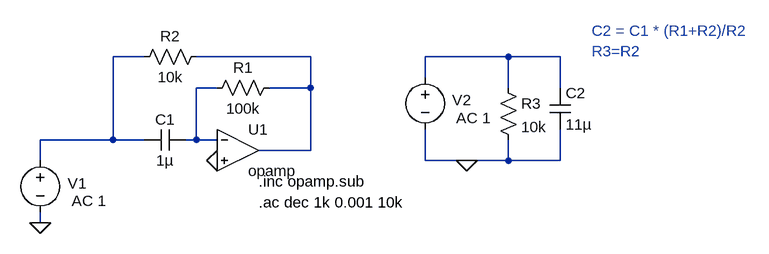
[diagram p0: schematic EJE3_A.asc]
EJE3_A.asc, the LTspice schematic file:
Version 4
SHEET 1 928 680
WIRE -32 -48 -80 -48
WIRE 224 -48 48 -48
WIRE 528 -48 400 -48
WIRE 608 -48 528 -48
WIRE 400 -16 400 -48
WIRE 80 0 48 0
WIRE 224 0 224 -48
WIRE 224 0 160 0
WIRE 528 0 528 -48
WIRE 608 0 608 -48
WIRE -80 80 -80 -48
WIRE -80 80 -192 80
WIRE -32 80 -80 80
WIRE 48 80 48 0
WIRE 48 80 32 80
WIRE 80 80 48 80
WIRE 224 96 224 0
WIRE 224 96 144 96
WIRE -192 112 -192 80
WIRE 400 112 400 64
WIRE 464 112 400 112
WIRE 528 112 528 80
WIRE 528 112 464 112
WIRE 608 112 608 64
WIRE 608 112 528 112
WIRE -192 208 -192 192
FLAG 80 112 0
FLAG -192 208 0
FLAG 464 112 0
SYMBOL OpAmps\\opamp 112 32 R0
SYMATTR InstName U1
SYMATTR SpiceLine2 GBW=100Meg
SYMBOL voltage -192 96 R0
WINDOW 0 42 51 Left 2
WINDOW 123 48 78 Left 2
WINDOW 39 0 0 Left 0
SYMATTR InstName V1
SYMATTR Value ""
SYMATTR Value2 AC 1
SYMBOL cap 32 64 R90
WINDOW 0 0 32 VBottom 2
WINDOW 3 32 32 VTop 2
SYMATTR InstName C1
SYMATTR Value 1µ
SYMBOL res 176 -16 R90
WINDOW 0 0 56 VBottom 2
WINDOW 3 32 56 VTop 2
SYMATTR InstName R1
SYMATTR Value 100k
SYMBOL res 64 -64 R90
WINDOW 0 0 56 VBottom 2
WINDOW 3 32 56 VTop 2
SYMATTR InstName R2
SYMATTR Value 10k
SYMBOL res 512 -16 R0
SYMATTR InstName R3
SYMATTR Value 10k
SYMBOL cap 592 0 R0
SYMATTR InstName C2
SYMATTR Value 11µ
SYMBOL voltage 400 -32 R0
WINDOW 0 42 51 Left 2
WINDOW 123 48 78 Left 2
WINDOW 39 0 0 Left 0
SYMATTR InstName V2
SYMATTR Value ""
SYMATTR Value2 AC 1
TEXT 144 144 Left 2 !.inc opamp.sub
TEXT 144 176 Left 2 !.ac dec 1k 0.001 10k
TEXT 656 -88 Left 2 ;C2 = C1 * (R1+R2)/R2\nR3=R2

The netlist it stands for:
* EJE3_A.asc
XU1 N004 0 N002 opamp Aol=100K GBW=100Meg  ; pins invin noninvin out
V1 N001 0 AC 1
C1 N004 N001 1µ
R1 N002 N004 100k
R2 N002 N001 10k
R3 N003 0 10k
C2 N003 0 11µ
V2 N003 0 AC 1
.inc opamp.sub
.ac dec 1k 0.001 10k
* C2 = C1 * (R1+R2)/R2
* R3=R2
.backanno
.end